# EAGLE schematic Twatch v2b (EAGLE 5.07)
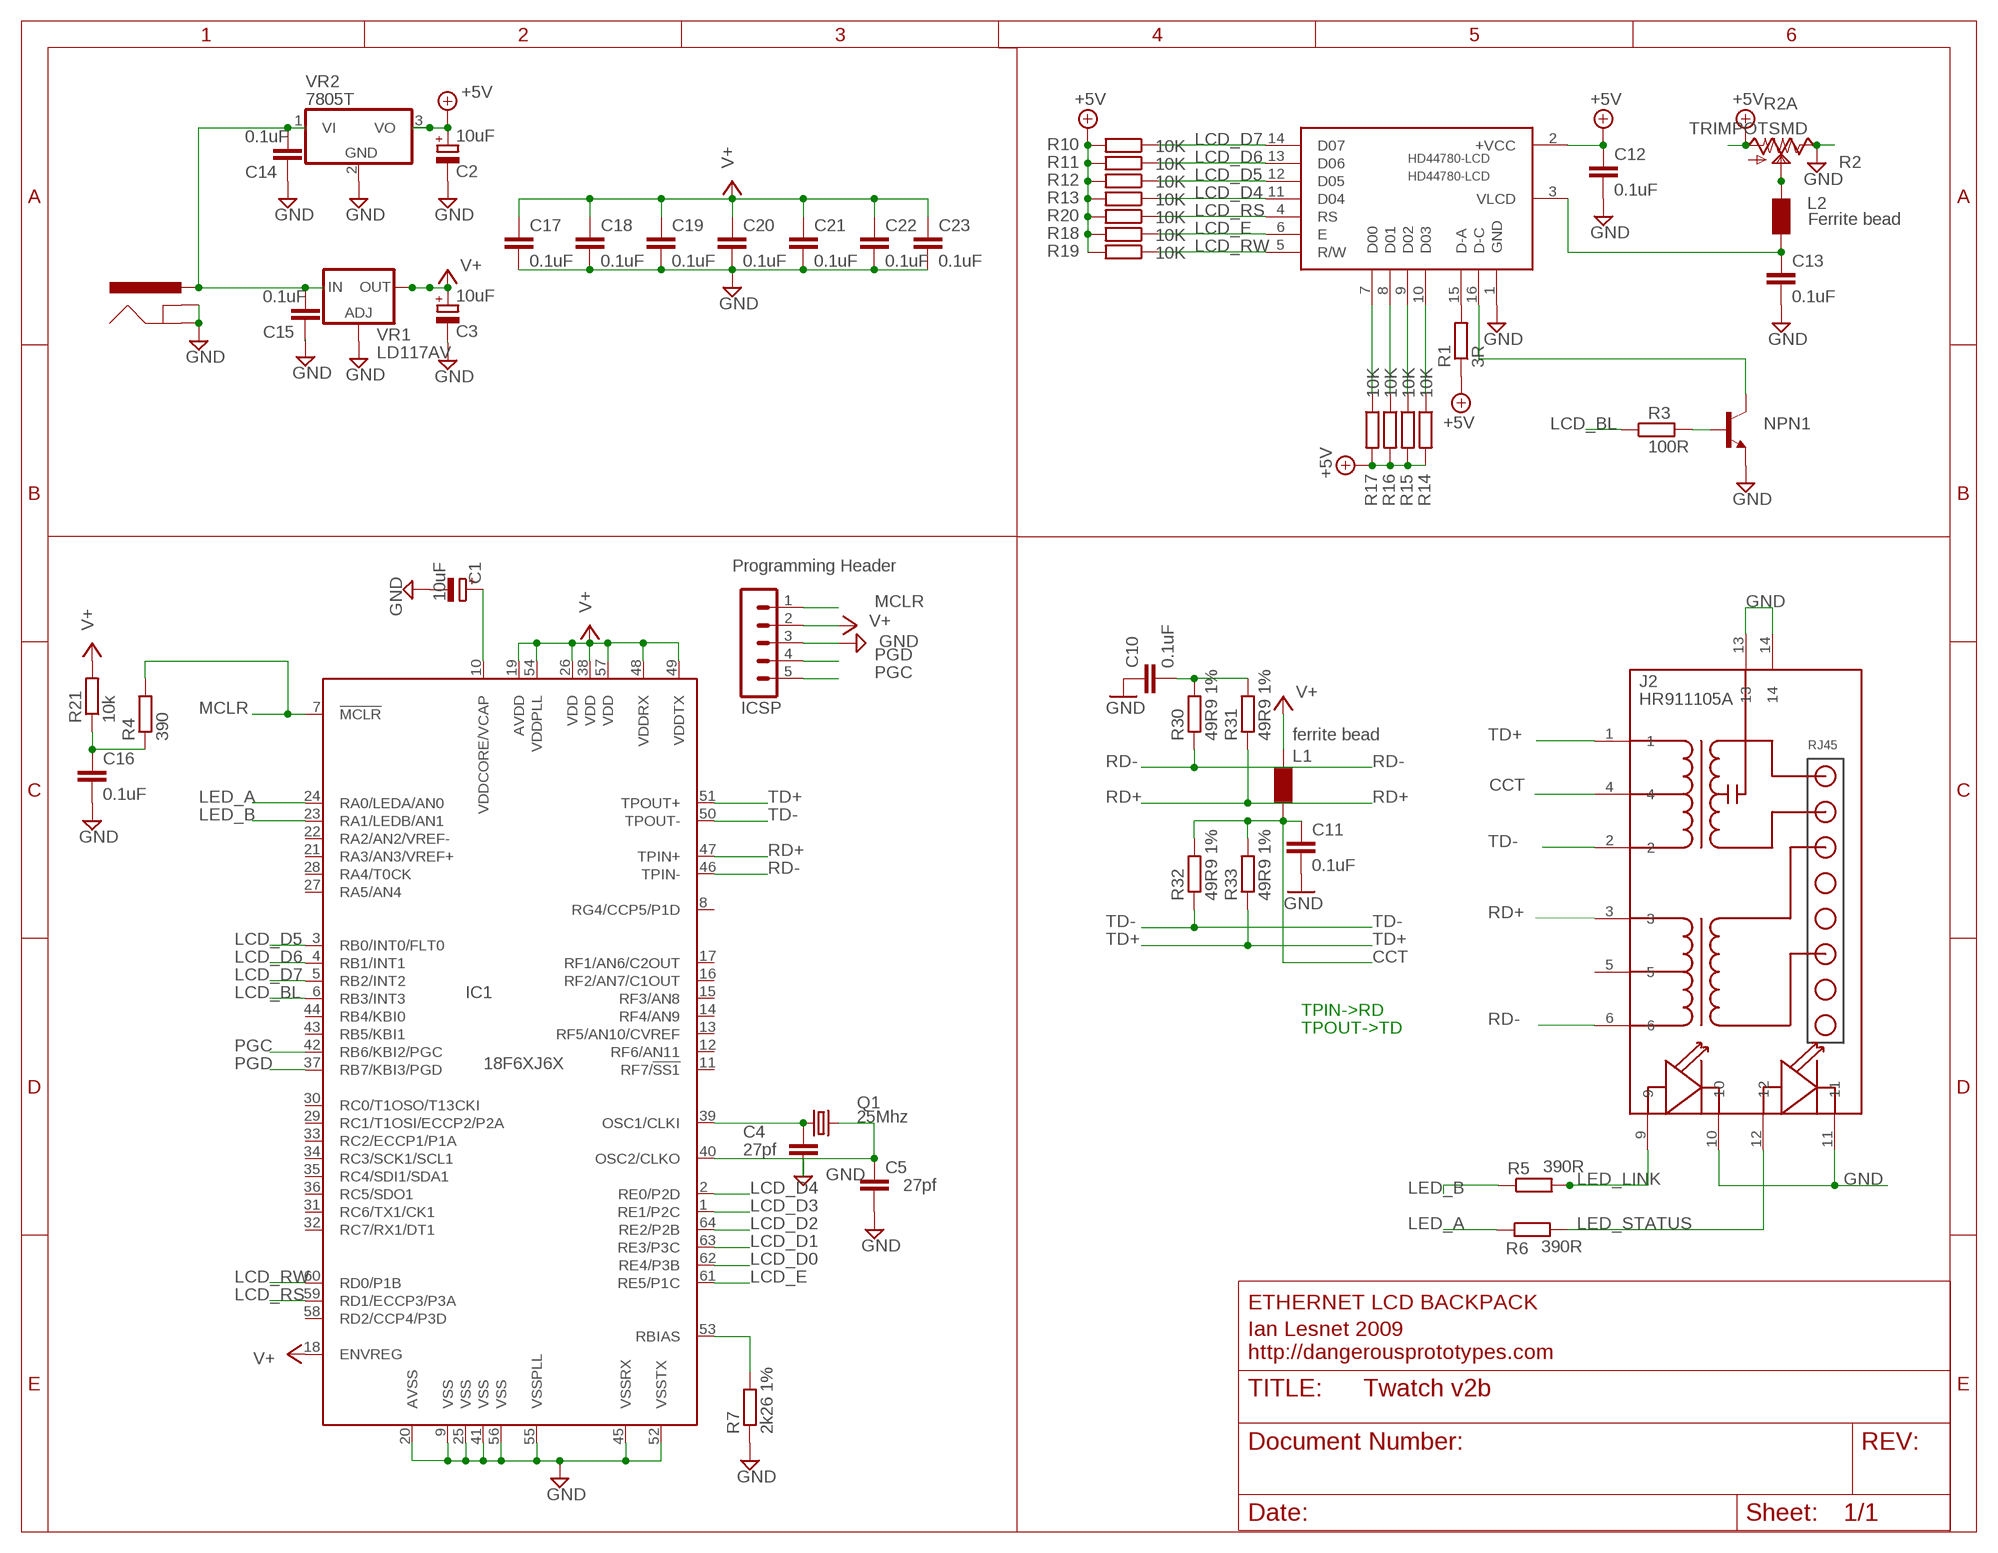
[diagram p0: schematic, sheet 1]

## Parts
C1  10uF  CPOL-EUSMCA  [SMC_A]
C2  10uF  CPOL-EUSMCA  [SMC_A]
C3  10uF  CPOL-EUSMCA  [SMC_A]
C4  27pf  C-EUC0805  [C0805]
C5  27pf  C-EUC0805  [C0805]
C10  0.1uF  C-EUC0805  [C0805]
C11  0.1uF  C-EUC0805  [C0805]
C12  0.1uF  C-EUC0805  [C0805]
C13  0.1uF  C-EUC0805  [C0805]
C14  0.1uF  C-EUC0805  [C0805]
C15  0.1uF  C-EUC0805  [C0805]
C16  0.1uF  C-0805  [C0805]
C17  0.1uF  C-0805  [C0805]
C18  0.1uF  C-0805  [C0805]
C19  0.1uF  C-0805  [C0805]
C20  0.1uF  C-0805  [C0805]
C21  0.1uF  C-0805  [C0805]
C22  0.1uF  C-0805  [C0805]
C23  0.1uF  C-0805  [C0805]
HD44780-LCD  HD44780-LCD  [HD44780]
IC1  18F6XJ6X  [TQFP64-10X10]
ICSP  MA05-1  [MA05-1]
J1  POWER_JACKSMD  [POWER_JACK_SMD]
J2  HR911105A  [HR911105A]
L1  ferrite bead  WE-KIL_0805  [WE-KI_0805_B]
L2  Ferrite bead  WE-KIL_0805  [WE-KI_0805_B]
NPN1  TRANSISTOR_NPNSOT23  [SOT23]
Q1  25Mhz  CRYSTALHC49UP  [HC49UP]
R1  3R  R-EU_0207/10  [0207/10]
R2  TRIMPOTSMD  [TRIMPOT-3MM]
R2A  TRIM_US-CA6V  [CA6V]
R3  100R  R-EU_R0805  [R0805]
R4  390  R-EU_M0805  [M0805]
R5  390R  R-EU_R0805  [R0805]
R6  390R  R-EU_R0805  [R0805]
R7  2k26 1%  R-EU_M0805  [M0805]
R10  10K  R-EU_R0805  [R0805]
R11  10K  R-EU_R0805  [R0805]
R12  10K  R-EU_R0805  [R0805]
R13  10K  R-EU_R0805  [R0805]
R14  10K  R-EU_R0805  [R0805]
R15  10K  R-EU_R0805  [R0805]
R16  10K  R-EU_R0805  [R0805]
R17  10K  R-EU_R0805  [R0805]
R18  10K  R-EU_R0805  [R0805]
R19  10K  R-EU_R0805  [R0805]
R20  10K  R-EU_R0805  [R0805]
R21  10k  R-EU_M0805  [M0805]
R30  49R9 1%  R-EU_R0805  [R0805]
R31  49R9 1%  R-EU_R0805  [R0805]
R32  49R9 1%  R-EU_R0805  [R0805]
R33  49R9 1%  R-EU_R0805  [R0805]
VR1  LD117AV  [TO220L1]
VR2  7805T  [TO220H]

## Nets
+5V: C2.+ C12.1 HD44780-LCD.2(+VCC) R1.1 R2.3(CW) R2A.A R10.2 R11.2 R12.2 R13.2 R14.2 R15.2 R16.2 R17.2 R18.2 R19.2 R20.2 VR2.3(VO)
CCT: C11.1 J2.4 L1.2 R32.2 R33.2
GND: C1.- C2.- C3.- C4.2 C5.2 C10.1 C11.2 C12.2 C13.2 C14.2 C15.2 C16.2 C17.2 C18.2 C19.2 C20.2 C21.2 C22.2 C23.2 HD44780-LCD.1(GND) IC1.9(VSS) IC1.20(AVSS) IC1.25(VSS) IC1.41(VSS) IC1.45(VSSRX) IC1.52(VSSTX) IC1.55(VSSPLL) IC1.56(VSS) ICSP.3 J1.GND(GNDBREAK) J1.P$4(GND) J2.10 J2.11 J2.13 J2.14 NPN1.2(E) R2.1(CCW) R2A.E R7.1 VR1.1(ADJ) VR2.2(GND)
LCD_BL: IC1.6(RB3/INT3) R3.1
LCD_D0: HD44780-LCD.7(D00) IC1.62(RE4/P3B) R17.1
LCD_D1: HD44780-LCD.8(D01) IC1.63(RE3/P3C) R16.1
LCD_D2: HD44780-LCD.9(D02) IC1.64(RE2/P2B) R15.1
LCD_D3: HD44780-LCD.10(D03) IC1.1(RE1/P2C) R14.1
LCD_D4: HD44780-LCD.11(D04) IC1.2(RE0/P2D) R13.1
LCD_D5: HD44780-LCD.12(D05) IC1.3(RB0/INT0/FLT0) R12.1
LCD_D6: HD44780-LCD.13(D06) IC1.4(RB1/INT1) R11.1
LCD_D7: HD44780-LCD.14(D07) IC1.5(RB2/INT2) R10.1
LCD_E: HD44780-LCD.6(E) IC1.61(RE5/P1C) R18.1
LCD_RS: HD44780-LCD.4(RS) IC1.59(RD1/ECCP3/P3A) R20.1
LCD_RW: HD44780-LCD.5(R/W) IC1.60(RD0/P1B) R19.1
LED_A: IC1.24(RA0/LEDA/AN0) R6.1
LED_B: IC1.23(RA1/LEDB/AN1) R5.1
LED_LINK: J2.9 R5.2
LED_STATUS: J2.12 R6.2
MCLR: IC1.7(!MCLR) ICSP.1 R4.2
N$10: L2.1 R2.2(WIPER) R2A.S
N$11: NPN1.1(B) R3.2
N$14: C1.+ IC1.10(VDDCORE/VCAP)
N$15: C4.1 IC1.39(OSC1/CLKI) Q1.1
N$16: C5.1 IC1.40(OSC2/CLKO) Q1.2
N$17: C13.1 HD44780-LCD.3(VLCD) L2.2
N$18: HD44780-LCD.15(D-A) R1.2
N$20: HD44780-LCD.16(D-C) NPN1.3(C)
N$22: C10.2 R30.2 R31.2
N$24: C16.1 R4.1 R21.1
N$50: IC1.53(RBIAS) R7.2
PGC: IC1.42(RB6/KBI2/PGC) ICSP.5
PGD: IC1.37(RB7/KBI3/PGD) ICSP.4
RD+: IC1.47(TPIN+) J2.3 R31.1
RD-: IC1.46(TPIN-) J2.6 R30.1
TD+: IC1.51(TPOUT+) J2.1 R33.1
TD-: IC1.50(TPOUT-) J2.2 R32.1
V+: C3.+ C17.1 C18.1 C19.1 C20.1 C21.1 C22.1 C23.1 IC1.18(ENVREG) IC1.19(AVDD) IC1.26(VDD) IC1.38(VDD) IC1.48(VDDRX) IC1.49(VDDTX) IC1.54(VDDPLL) IC1.57(VDD) ICSP.2 L1.1 R21.2 VR1.2(OUT)
VBAT: C14.1 C15.1 J1.VIN0(PWR) VR1.3(IN) VR2.1(VI)
Unconnected: IC1.8(RG4/CCP5/P1D) IC1.11(RF7/!SS1) IC1.12(RF6/AN11) IC1.13(RF5/AN10/CVREF) IC1.14(RF4/AN9) IC1.15(RF3/AN8) IC1.16(RF2/AN7/C1OUT) IC1.17(RF1/AN6/C2OUT) IC1.21(RA3/AN3/VREF+) IC1.22(RA2/AN2/VREF-) IC1.27(RA5/AN4) IC1.28(RA4/T0CK) IC1.29(RC1/T1OSI/ECCP2/P2A) IC1.30(RC0/T1OSO/T13CKI) IC1.31(RC6/TX1/CK1) IC1.32(RC7/RX1/DT1) IC1.33(RC2/ECCP1/P1A) IC1.34(RC3/SCK1/SCL1) IC1.35(RC4/SDI1/SDA1) IC1.36(RC5/SDO1) IC1.43(RB5/KBI1) IC1.44(RB4/KBI0) IC1.58(RD2/CCP4/P3D) J2.5

## Notes on the sheet
- Programming Header
- TPIN->RD
- TPOUT->TD
- ETHERNET LCD BACKPACK
- Ian Lesnet 2009
- http://dangerousprototypes.com

## Library data of the parts
C1-C3 = rcl:CPOL-EU: POLARIZED CAPACITOR, European symbol
C4 C5 C10-C15 = rcl:C-EU: CAPACITOR, European symbol
C16-C23 = quantum-sensor:C: Capacitor
HD44780-LCD = lcd-hd44780:HD44780-LCD
IC1 = microchip_enet:18F6XJ6X
ICSP = con-lstb:MA05-1: PIN HEADER
J1 = SparkFun:POWER_JACK: Power Jack This is the standard 5.5mm barrel jack for power. The PTH is the most common, proven, reliable, footprint. All others are experimental. The Slot footprint only works if the mill layer is transmitted to the PCB fab house so be warned. Spark Fun Electronics SKU : PRT-00119. Mating wall wart : TOL-00298 (and others)
J2 = CONNECTER:HR911105A
L1 L2 = wuerth-elektronik:WE-KIL: SMD Wire Wound Ceramic Inductor WE-KIL - Low profile - High Q values -- Bluetooth -- Wireless LAN -- RF oscillation circuit -- IF impedance matching
NPN1 = SparkFun:TRANSISTOR_NPN: Transistor NPN BJT configuration in SOT23 package. MMBT2222 is the common NPN we use. Double check BCE configuration again layout.
Q1 = crystal:CRYSTAL: CRYSTAL
R1 R3-R7 R10-R21 R30-R33 = rcl:R-EU_: RESISTOR, European symbol
R2 = SparkFun:TRIMPOT
R2A = pot:TRIM_US-: POTENTIOMETER
VR1 = v-reg:LD117A?*: Low drop fixed and adjustable positive voltage regulators 1 A Source: http://www.st.com/stonline/products/literature/ds/7194/ld1117axx.pdf
VR2 = linear:78*: Positive VOLTAGE REGULATOR Source: http://cache.national.com/ds/LM/LM78L05.pdf http://www.fairchildsemi.com/ds/LM/LM7805.pdf